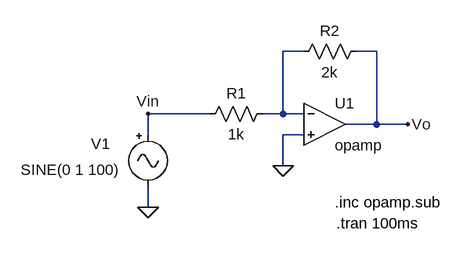
[diagram p0: schematic inversor.asc]
inversor.asc, the LTspice schematic file:
Version 4
SHEET 1 880 680
WIRE 176 64 144 64
WIRE 288 64 256 64
WIRE 32 160 -64 160
WIRE 144 160 144 64
WIRE 144 160 112 160
WIRE 176 160 144 160
WIRE 288 176 288 64
WIRE 288 176 240 176
WIRE 336 176 288 176
WIRE -64 192 -64 160
WIRE 176 192 144 192
WIRE 144 240 144 192
WIRE -64 304 -64 272
FLAG 144 240 0
FLAG -64 304 0
FLAG 336 176 Vo
FLAG -64 160 Vin
SYMBOL OpAmps\\opamp 208 112 R0
SYMATTR InstName U1
SYMBOL res 128 144 R90
WINDOW 0 0 56 VBottom 2
WINDOW 3 32 56 VTop 2
SYMATTR InstName R1
SYMATTR Value 1k
SYMBOL res 272 48 R90
WINDOW 0 0 56 VBottom 2
WINDOW 3 32 56 VTop 2
SYMATTR InstName R2
SYMATTR Value 2k
SYMBOL Misc\\signal -64 176 R0
WINDOW 0 -88 30 Left 2
WINDOW 3 -196 70 Left 2
WINDOW 123 0 0 Left 0
WINDOW 39 0 0 Left 0
SYMATTR InstName V1
SYMATTR Value SINE(0 1 100)
TEXT 226 328 Left 2 !.tran 100ms
TEXT 224 296 Left 2 !.inc opamp.sub

The netlist it stands for:
* inversor.asc
XU1 N001 0 Vo opamp Aol=100K GBW=10Meg  ; pins invin noninvin out
R1 N001 Vin 1k
R2 Vo N001 2k
V1 Vin 0 SINE(0 1 100)
.tran 100ms
.inc opamp.sub
.backanno
.end